# EAGLE design Adafruit BMP183 Breakout (EAGLE 6.3)
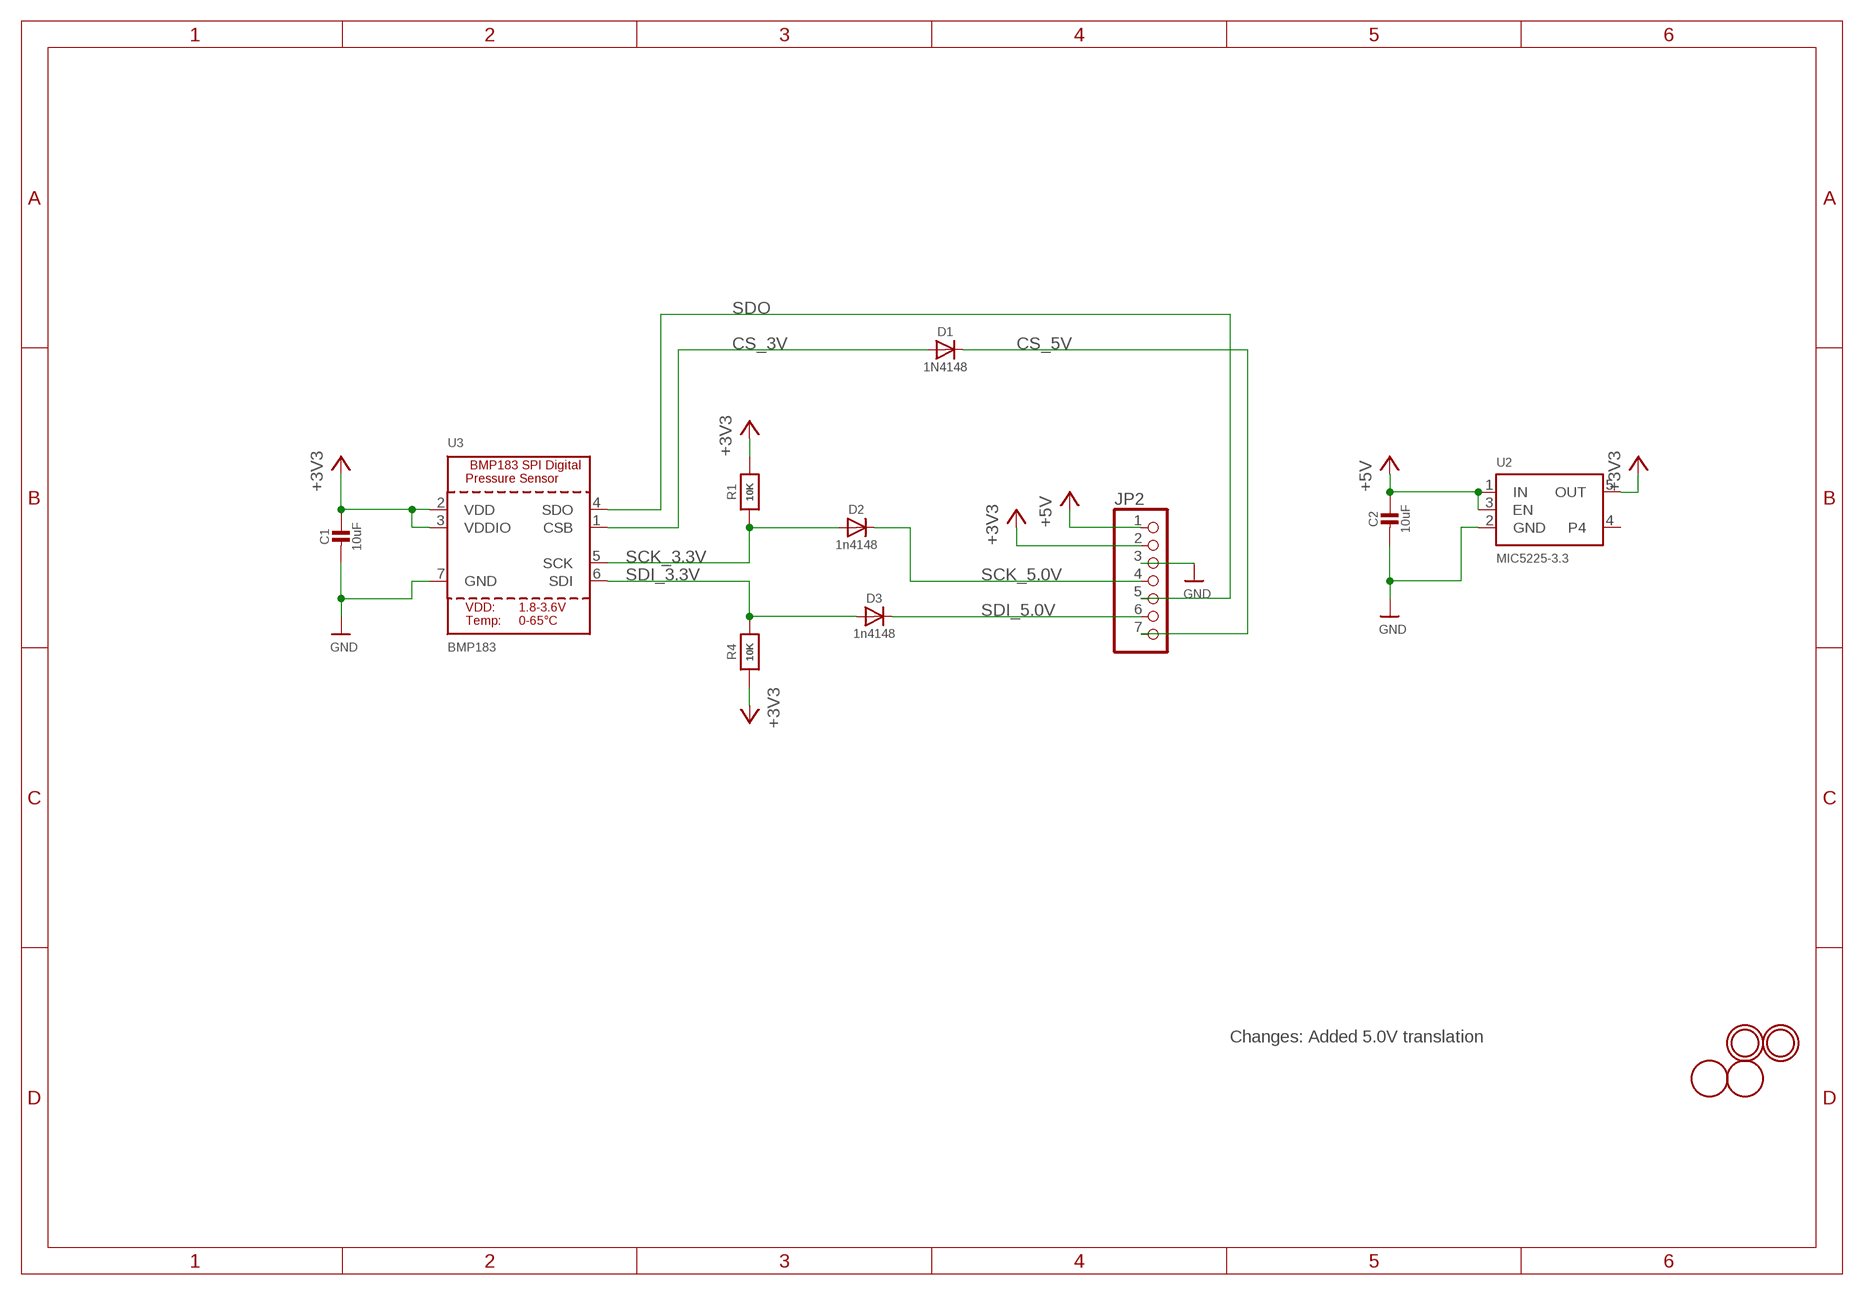
[diagram p0: schematic, sheet 1]

## Parts
C1  10uF  CAP_CERAMIC0805-NOOUTLINE  [0805-NO]
C2  10uF  CAP_CERAMIC0805-NOOUTLINE  [0805-NO]
D1  1N4148  DIODESOD-323  [SOD-323]
D2  1n4148  DIODESOD-323  [SOD-323]
D3  1n4148  DIODESOD-323  [SOD-323]
JP2  HEADER-1X770MIL  [1X07_ROUND_70]
R1  10K  RESISTOR0805_NOOUTLINE  [0805-NO]
R4  10K  RESISTOR0805_NOOUTLINE  [0805-NO]
U2  MIC5225-3.3  VREG_SOT23-5  [SOT23-5]
U3  BMP183  [BMP18X_EXTENDED]
U$5  FIDUCIAL  [FIDUCIAL_1MM]
U$7  MOUNTINGHOLE2.0  [MOUNTINGHOLE_2.0_PLATED]
U$8  MOUNTINGHOLE2.0  [MOUNTINGHOLE_2.0_PLATED]
U$15  FIDUCIAL  [FIDUCIAL_1MM]

## Nets
+3V3: C1.1 JP2.2 R1.2 R4.1 U2.5(OUT) U3.2(VDD) U3.3(VDDIO)
+5V: C2.1 JP2.1 U2.1(IN) U2.3(EN)
CS_3V: D1.A U3.1(CSB)
CS_5V: D1.C JP2.7
GND: C1.2 C2.2 JP2.3 U2.2(GND) U3.7(GND)
SCK_3.3V: D2.A R1.1 U3.5(SCK)
SCK_5.0V: D2.C JP2.4
SDI_3.3V: D3.A R4.2 U3.6(SDI)
SDI_5.0V: D3.C JP2.6
SDO: JP2.5 U3.4(SDO)
Unconnected: U2.4

## Notes on the sheet
- Changes: Added 5.0V translation

## Library data of the parts
C1 C2 = microbuilder:CAP_CERAMIC: Ceramic Capacitors For new designs, use the packages preceded by an '_' character since they are more reliable: The following footprints should be used on most boards: _0402 - Standard footprint for regular board layouts _0603 - Standard footprint for regular board layouts _0805 - Standard footprint for regular board layouts _1206 - Standard footprint for regular board layouts For extremely tight-pitch boards where space is at a premium, the following 'micro-pitch' footprints can be used (smaller pads, no silkscreen outline, etc.): _0402MP - Micro-pitch footprint for very dense/compact boards _0603MP - Micro-pitch footprint for very dense/compact boards _0805MP - Micro-pitch footprint for very dense/compact boards _1206MP - Micro-pitch footprint for very dense/compact boards
D1-D3 = microbuilder:DIODE: Diode SMA Model Volts Amps Type Vf Ir Digikey # Notes SSA34-E3 40V 3A Schottky 480mV @ 3A 200uA @ 40V SSA34-E3/61TGITR-ND CDBA120-G 20V 1A Schottky 500mV @ 1A 500uA @ 20V 641-1014-6-ND REEL MBRA210 10V 2A Schottky 350mV @ 2A 700uA @ 10V MBRA210LT3 SOD-123 Model Volts Amps Type Vf Ir Order # Notes BAT54T1G 30V 200mA Schottky 800mV @ 200mA 2uA @ 25V BAT54T1GOSTR-ND B0530W 30V 500mA Schottky 430mV @ 500mA 130uA @ 30V B0530W-FDICT-ND REEL MBR120 20V 1A Schottky 340mV @ 1A MBR120VLSFT1GOSCT-ND SOD-323 Model Volts Amps Type Vf Ir Order # Notes PMEG2005EJ 20V 500mA Schottky 355mV @ 500mA 568-4110-1-ND ZLLS410 10V 570mA Schottky 380mV @ 570mA ZLLS410CT-ND 1N4148WS 75V 150mA Silicon/Simple 1V 1N4148WSFSCT-ND REEL SOD-523 Model Volts Amps Type Vf Ir Order # Notes BAT54XV2 30V 200mA Schottky 0.8V @ 100mA BAT54XV2CT-ND TB751S 30V 30mA Schottky RB751S-40TE61CT-ND SOT23-R/W (R = Solder Paste/Reflow Ovens, W = Hand-Soldering) Model Volts Amps Type Vf Ir Order # Notes BAT54FILM 40V 300mA Schottky 497-7162-1-ND POWERDI-5 Model Volts Amps Type Vf Ir Order # Notes PDS560 60V 5A Schottky 670mV @ 5A 150uA @ 60V PDS560DICT-ND
JP2 = microbuilder:HEADER-1X7: PIN HEADER
R1 R4 = microbuilder:RESISTOR: Resistors For new designs, use the packages preceded by an '_' character since they are more reliable: The following footprints should be used on most boards: _0402 - Standard footprint for regular board layouts _0603 - Standard footprint for regular board layouts _0805 - Standard footprint for regular board layouts _1206 - Standard footprint for regular board layouts For extremely tight-pitch boards where space is at a premium, the following 'micro-pitch' footprints can be used (smaller pads, no silkscreen outline, etc.): _0402MP - Micro-pitch footprint for very dense/compact boards _0603MP - Micro-pitch footprint for very dense/compact boards _0805MP - Micro-pitch footprint for very dense/compact boards _1206MP - Micro-pitch footprint for very dense/compact boards
U2 = microbuilder:VREG_SOT23-5: SOT23-5 Fixed Voltage Regulators Part Current Out V Out V In V Dropout θJA (°C/W) TJ (°C) Digikey Part No. ADP121 150mA 3.3V 3.4-5.5V 0.09V @ 150mA -- -- ADP121-AUJZ33R7CT-ND ADP121 150mA 3.0V 3.1-5.5V 0.09V @ 150mA -- -- ADP121-AUJZ30R7CT-ND ADP122 300mA 3.3V 3.4-5.5V 0.085V @ 300mA -- -- ADP122AUJZ-3.3-R7CT-ND ADP1712 300mA 3.3V 3.5-5.5V 0.17V @ 300mA -- -- ADP1712AUJZ-3.3-R7TR-ND AP7311 (Low Cost) 150mA 3.3V 3.5-6V 0.15V @ 150mA -- -- AP7311-33WG-7DICT-ND LD39015M18R 150mA 1.8V 1.9V-5.5V 0.08V @ 100mA -- -- 497-6977-1-ND LP2985A-33DBVR 150mA 3.3V 3.3-16V 0.28V @ 150mA 206 150 296-18479-1-ND MCP1824T-3302E/OT 300mA 3.3V 3.5V-6V 0.2V @ 300mA -- -- MCP1824T-3302E/OTCT-ND MIC5205-2.5YM5 TR 150mA 2.5V 2.7-16V 0.165V @ 150mA -- -- 576-1257-2-ND MIC5205-3.0YM5 TR 150mA 3.0V 3.2V-16V 0.165V @ 150mA -- -- 576-1258-2-ND MIC5205-3.3YM5 TR 150mA 3.3V 3.5V-16V 0.165V @ 150mA -- -- 576-1259-2-ND TPS780330220 150mA 3.3V+2.2V 3.6-5.5V 250mV Max -- -- 296-23332-1-ND TDA3663/N1,135 100mA 3.3V 3.5-45V 0.18V @ 50mA -- -- 568-5343-1-ND Max operating temp can be calculated using θJA, TJ (max junction temperature), and power in watts. Set the "Maximum Ambient Temperature" until it reaches TJ ("Max Junction Temperature"), which is the absolute limit for safe use of the regulator: Heat Sink Temperature Calculator <http://www.daycounter.com/Calculators/Heat-Sink-Temperature-Calculator.phtml> For example, With 12V source into a 3.3V LP2985 and a 30mA load, we are dissipating (12V-3.3V) * 0.03A = 0.261W. With a θJA of 206 °C/W, a TJ of 150°C, and 261mW we can safely use the chip without a heat sink up to 75°C (=147.1°C Junction Temperature).
U3 = microbuilder:BMP183
U$5 U$15 = adafruit:FIDUCIAL: For use by pick and place machines to calibrate the vision/machine, 1mm By microbuilder.eu
U$7 U$8 = microbuilder:MOUNTINGHOLE: Mounting Hole For #2 screws (0.086"/2.18mm width, 0.094"/2.4mm hole) use 2.5mm; BOM: EXCLUDE

## Board
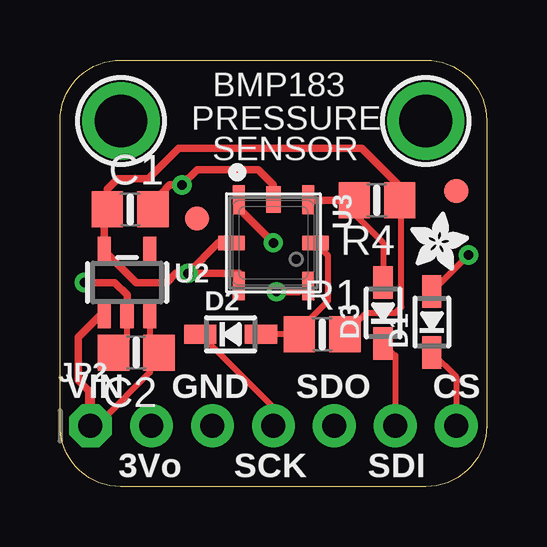
[diagram p1: board, top side]
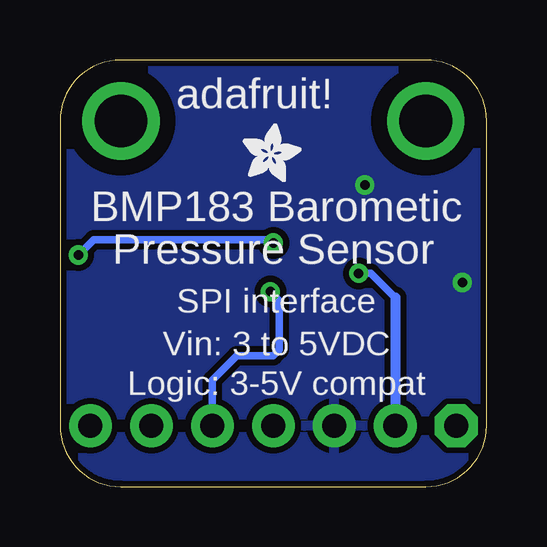
[diagram p2: board, bottom side, seen from below]

Size 17.78 x 17.78 mm. Coordinates in mm from the lower left corner, seen from the top.
Outline: 15.24,0 2.54,0 arc-90 0,2.54 0,15.24 arc-90 2.54,17.78 15.24,17.78 arc-90 17.78,15.24 17.78,2.54 arc-90 15.24,0
Copper layers (1*16): Top 0.035mm / dielectric 1.5mm / Bottom 0.035mm
Design rules "adafruit *": minimum track width 8mil, minimum drill 15.5mil, track to track 8mil, track to pad 8mil, pad to pad 8mil, via to via 8mil, smd to smd 8mil, copper to edge 10mil, drill to drill 8mil, minimum pad ring 10mil, minimum via ring 8mil, stop-mask expansion 4mil, vias tented up to drill 20mil, thermal gap 10mil

### Footprints (pad centres in the part's own frame; a part is rotated, then mirrored left to right if it is on the bottom)
0805-NO = smd 1.3 x 1.5: 1 -0.95,0; 2 0.95,0
SOD-323 = smd 1.35 x 0.8: A 1.27,0; C -1.27,0
1X07_ROUND_70 = drill 1 pad 1.778 octagon: 1 -7.62,0 | drill 1 pad 1.778: 2 -5.08,0; 3 -2.54,0; 4 0,0; 5 2.54,0; 6 5.08,0; 7 7.62,0
SOT23-5 = smd 0.55 x 1.2: 1 -0.95,-1.3; 2 0,-1.3; 3 0.95,-1.3; 4 0.95,1.3; 5 -0.95,1.3
BMP18X_EXTENDED = smd 1.2 x 0.5: 1 -1.8,-1.45; 3 1.8,-1.45; 4 1.8,1.45; 6 -1.8,1.45 | smd 0.6 x 1.1: 2 0,-1.75; 5 0,1.75 | smd 1.1 x 0.6: 7 -1.8,0
FIDUCIAL_1MM = smd 1 x 1: 1 0,0
MOUNTINGHOLE_2.0_PLATED = drill 2.2 pad 3: P$1 0,0

### Placement (x,y rotation side)
C1  2.92,11.56 0 top
C2  3.17,5.59 180 top
D1  15.49,6.86 90 top
D2  7.11,6.35 0 top
D3  13.46,7.24 90 top
JP2  8.89,2.54 0 top
R1  10.92,6.35 0 top
R4  13.21,11.94 180 top
U2  2.79,8.51 0 top
U3  8.89,10.16 270 top
U$2  [ADAFRUIT_2.5MM]  10.16,12.7 0 bottom
U$5  5.71,11.18 0 top
U$6  [ADAFRUIT_2.5MM]  14.61,9.02 0 top
U$7  2.54,15.24 0 top
U$8  15.24,15.24 0 top
U$15  16.51,12.32 0 top

### Tracks (layer width: path | path; a pad name or v marks a point on that pad's centre or on a via)
+3V3  (via drill 0.39)
  Top 0.254: R1.2 12.76,7.24 13.97,7.24 14.22,7.49 14.22,11.94 R4.1
  Top 0.305: C1.1 1.84,11.56 U2.5 1.88,9.81 3.17,8.51 4.45,8.51 4.83,8.89 v5.33,8.89 | v5.33,8.89 6.6,10.16 U3.2 | U3.3 7.44,8.89 v5.33,8.89 | C1.1 1.97,12 | 14.22,12 R4.1 14.16,12.51 12.57,14.1 4.95,14.1 3.68,12.83 2.41,12.83 1.97,12.38 C1.1
  Bottom 0.305: 3.81,7.87 4.83,8.89 v5.33,8.89
  Bottom 0.406: 3.81,7.87 JP2.2
+5V
  Top 0.254: C2.1 3.74,5.97 U2.3 3.74,4.76 1.78,2.79 1.52,2.79 JP2.1
  Top 0.305: U2.1 1.75,7.21 0.76,6.22 0.76,4.45 1.27,3.94 | U2.3 3.77,7.24
  Top 0.406: JP2.1 1.27,3.94
CS_3V  (via drill 0.39)
  Top 0.254: D1.A v17.02,9.65
  Top 0.305: U3.1 7.44,11.61 v8.89,10.16
  Bottom 0.305: v8.89,10.16 9.02,10.29 16.38,10.29 v17.02,9.65
CS_5V
  Top 0.254: D1.C 16.51,4.57 JP2.7
GND  (via drill 0.39)
  Top 0.254: C2.2 2.79,6.16 U2.2
  Top 0.305: U3.7 8.89,12.57 8.26,13.21 5.71,13.21 v5.08,12.57 4.57,12.57 4.19,12.19 4.19,11.56 C1.2 | U2.2 2.79,8 2.29,8.51 v1.02,8.51
  pour Bottom (isolate 0.254): 0,17.78 17.78,17.78 17.91,0 0.13,0
SCK_3.3V
  Top 0.254: D2.A R1.1 9.97,6.54 11.18,7.75 11.18,9.62 U3.5
SCK_5.0V
  Top 0.254: D2.C 8.89,3.3 JP2.4
SDI_3.3V
  Top 0.254: R4.2 12.26,11.36 13.46,10.16 D3.A
  Top 0.305: R4.2 10.45,11.94 10.42,11.96 U3.6
SDI_5.0V
  Top 0.254: D3.C 13.97,5.46 JP2.6
SDO  (via drill 0.39)
  Top 0.254: U3.4 10.11,8.13 9.94,8.13
  Top 0.305: 9.94,8.13 v9.02,8.13
  Bottom 0.305: v9.02,8.13 8.64,7.75 8.64,5.71 8.89,5.46 10.41,5.46 11.43,4.45 JP2.5

### Text on the board
tPlace: BMP183 | PRESSURE | SENSOR | VIN | GND | SDO | CS | 3Vo | SCK | SDI
bPlace: adafruit! | BMP183 Barometic | Pressure Sensor | SPI interface | Vin: 3 to 5VDC | Logic: 3-5V compat